# EAGLE design ECE411-Group6-V2 (EAGLE 8.3.2)
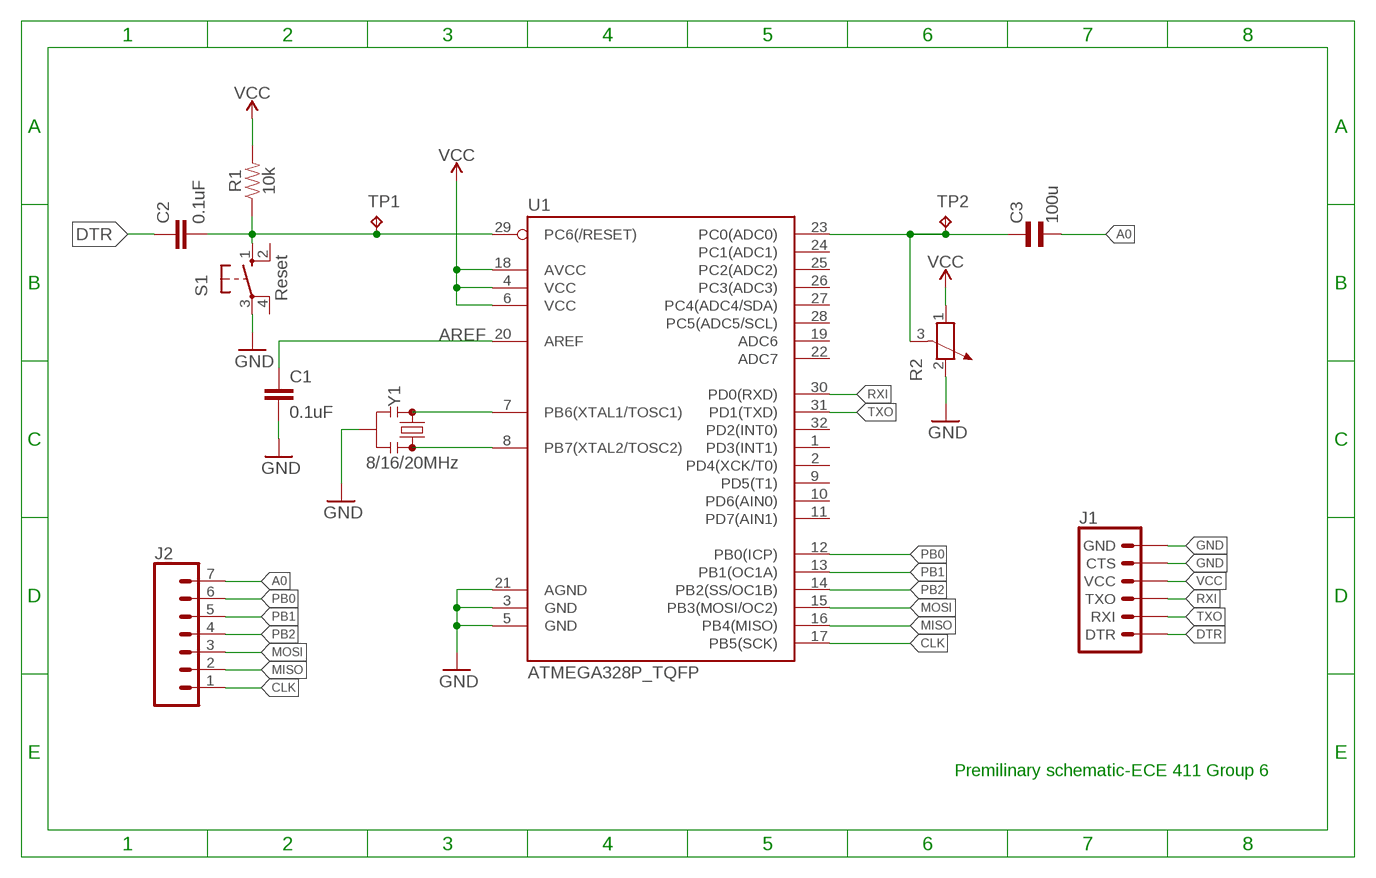
[diagram p0: schematic, sheet 1]

## Parts
C1  0.1uF  0.1UF-0603-25V-5%  [0603]
C2  0.1uF  0.1UF-0603-25V-5%  [0603]
C3  100u  EL-BI25-10AXIAL  [EU25-10]
J1  6_PIN_SERIAL_TARGET  [1X06]
J2  CONN_07  [1X07]
R1  10k  10KOHM-0603-1/10W-1%  [0603]
R2  POTENTIOMETER_PT-10  [PT-10]
S1  Reset  10-XX  [B3F-10XX]
TP1  TPB1,27  [B1,27]
TP2  TPB1,27  [B1,27]
U1  ATMEGA328P_TQFP  [TQFP32-08]
Y1  8/16/20MHz  RESONATORSMD-3.2X1.3  [RESONATOR-SMD-3.2X1.3]

## Nets
A0: C3.2 J2.7
AREF: C1.1 U1.20(AREF)
CLK: J2.1 U1.17(PB5(SCK))
DTR: C2.1 J1.1(DTR)
GND: C1.2 J1.5(CTS) J1.6(GND) R2.2 S1.3(P) U1.3(GND) U1.5(GND) U1.21(AGND) Y1.2
MISO: J2.2 U1.16(PB4(MISO))
MOSI: J2.3 U1.15(PB3(MOSI/OC2))
N$1: U1.7(PB6(XTAL1/TOSC1)) Y1.1
N$2: U1.8(PB7(XTAL2/TOSC2)) Y1.3
N$3: C2.2 R1.1 S1.1(S) TP1.TP U1.29(PC6(/RESET))
N$4: C3.1 R2.3 TP2.TP U1.23(PC0(ADC0))
PB0: J2.6 U1.12(PB0(ICP))
PB1: J2.5 U1.13(PB1(OC1A))
PB2: J2.4 U1.14(PB2(SS/OC1B))
RXI: J1.3(TXO) U1.30(PD0(RXD))
TXO: J1.2(RXI) U1.31(PD1(TXD))
VCC: J1.4(VCC) R1.2 R2.1 U1.4(VCC) U1.6(VCC) U1.18(AVCC)
Unconnected: S1.2(S1) S1.4(P1) U1.1(PD3(INT1)) U1.2(PD4(XCK/T0)) U1.9(PD5(T1)) U1.10(PD6(AIN0)) U1.11(PD7(AIN1)) U1.19(ADC6) U1.22(ADC7) U1.24(PC1(ADC1)) U1.25(PC2(ADC2)) U1.26(PC3(ADC3)) U1.27(PC4(ADC4/SDA)) U1.28(PC5(ADC5/SCL)) U1.32(PD2(INT0))

## Notes on the sheet
- Premilinary schematic-ECE 411 Group 6

## Library data of the parts
C1 C2 = SparkFun-Capacitors:0.1UF: 0.1µF ceramic capacitors A capacitor is a passive two-terminal electrical component used to store electrical energy temporarily in an electric field.; PROD_ID: CAP-08604
C3 = rcl:EL-: BIPOLAR ELECTROLYTIC CAPACITOR
J1 = SparkFun-Connectors:6_PIN_SERIAL_TARGET: 6-pin header connection for use with the "FTDI BASIC" pinout - TARGET SIDE. Also known as "Arduino Serial Program Header". It is used to mate with our FTDI Basic serial programmers using the Arduino IDE. Note, this device has "TARGET" in the name. It is intended to be used on a design that contains a target micro-controller that you wish to program. The "sister" device, named "CABLE" is inteneded to be used on a design that usually lives on the end of your USB cable and prvides the converter chip (FTDI232 or FTDI231x) to commnicate serial RX/TX. You can populate with some of these: Break Away Headers - Straight <https://www.sparkfun.com/products/116> (PRT-00116) For reference (or to suit your programming needs) check out these designs: SparkFun FTDI Basic Breakout - 5V <https://www.sparkfun.com/products/9716> (DEV-09716) SparkFun FTDI Basic Breakout - 3.3V <https://www.sparkfun.com/products/9873> (DEV-09873) SparkFun FTDI SmartBasic <https://www.sparkfun.com/products/12935> (DEV-12935) SparkFun Beefy 3 - FTDI Basic Breakout <https://www.sparkfun.com/products/13746> (DEV-13746)
J2 = SparkFun-Connectors:CONN_07: Multi connection point. Often used as Generic Header-pin footprint for 0.1 inch spaced/style header connections On any of the 0.1 inch spaced packages, you can populate with these: Break Away Headers - Straight <https://www.sparkfun.com/products/116> (PRT-00116) Break Away Male Headers - Right Angle <https://www.sparkfun.com/products/553> (PRT-00553) Female Headers <https://www.sparkfun.com/products/115> (PRT-00115) Break Away Headers - Machine Pin <https://www.sparkfun.com/products/117> (PRT-00117) Break Away Female Headers - Swiss Machine Pin <https://www.sparkfun.com/products/743> (PRT-00743) For SCREWTERMINALS and SPRING TERMINALS visit here: Screw Terimnals on SparkFun.com <https://www.sparkfun.com/search/results?term=Screw+Terminals> (5mm/3.5mm/2.54mm spacing) This device is also useful as a general connection point to wire up your design to another part of your project. Our various solder wires solder well into these plated through hole pads. Hook-Up Wire - Assortment (Stranded, 22 AWG) <https://www.sparkfun.com/products/11375> (PRT-11375) Hook-Up Wire - Assortment (Solid Core, 22 AWG) <https://www.sparkfun.com/products/11367> (PRT-11367) View the entire wire category on our website here <https://www.sparkfun.com/categories/141> Special notes: Molex polarized connector foot print use with SKU : PRT-08231 with associated crimp pins and housings. 1MM SMD Version SKU: PRT-10208 NOTES ON THE VARIANTS LOCK and LOCK_LONGPADS... This footprint was designed to help hold the alignment of a through-hole component (i.e. 6-pin header) while soldering it into place. You may notice that each hole has been shifted either up or down by 0.005 of an inch from it's more standard position (which is a perfectly straight line). This slight alteration caused the pins (the squares in the middle) to touch the edges of the holes. Because they are alternating, it causes a "brace" to hold the component in place. 0.005 has proven to be the perfect amount of "off-center" position when using our standard breakaway headers. Although looks a little odd when you look at the bare footprint, once you have a header in there, the alteration is very hard to notice. Also,if you push a header all the way into place, it is covered up entirely on the bottom side.
R1 = SparkFun-Resistors:10KOHM: 10kΩ resistor A resistor is a passive two-terminal electrical component that implements electrical resistance as a circuit element. Resistors act to reduce current flow, and, at the same time, act to lower voltage levels within circuits. - Wikipedia; PROD_ID: RES-00824
R2 = rcl:POTENTIOMETER_: Potentiometer
S1 = switch-omron:10-XX: OMRON SWITCH; MPN: B3F-1000; OC_FARNELL: 176432; OC_NEWARK: 36M3542
TP1 TP2 = testpad:TP: Test pad
U1 = SparkFun-IC-Microcontroller:ATMEGA328P_TQFP: Popular 328P in QFP Storefront component: ATmega328 - TQFP <https://www.sparkfun.com/products/13448> (COM-13448) Datasheet <http://www.sparkfun.com/datasheets/Components/SMD/ATMega328.pdf> SparkFun Products SparkFun RedBoard - Programmed with Arduino <https://www.sparkfun.com/products/12757> (DEV-12757) Arduino Pro Mini 328 - 5V/16MHz <https://www.sparkfun.com/products/11113> (DEV-11113) Arduino Pro Mini 328 - 3.3V/8MHz <https://www.sparkfun.com/products/11114> (DEV-11114) SparkFun OpenLog <https://www.sparkfun.com/products/13712> (DEV-13712) SparkFun MicroView - OLED Arduino Module <https://www.sparkfun.com/products/12923> (DEV-12923) SparkFun Digital Sandbox <https://www.sparkfun.com/products/12651> (DEV-12651) SparkFun PicoBoard <https://www.sparkfun.com/products/11888> (WIG-11888) Arduino Fio <https://www.sparkfun.com/products/10116> (DEV-10116) LilyPad Arduino 328 Main Board <https://www.sparkfun.com/products/13342> (DEV-13342) SparkFun RedStick <https://www.sparkfun.com/products/13741> (DEV-13741) LilyPad MP3 <https://www.sparkfun.com/products/11013> (DEV-11013) LilyPad Arduino SimpleSnap <https://www.sparkfun.com/products/10941> (DEV-10941) SparkFun Stepoko <https://www.sparkfun.com/products/13899> (ROB-13899) SparkFun Geiger Counter <https://www.sparkfun.com/products/11345> (SEN-11345) SparkFun EL Sequencer <https://www.sparkfun.com/products/12781> (COM-12781) Arduino Pro 328 - 5V/16MHz <https://www.sparkfun.com/products/10915> (DEV-10915) CryptoCape <https://www.sparkfun.com/products/12773> (DEV-12773) SparkFun IR Thermometer Evaluation Board - MLX90614 <https://www.sparkfun.com/products/10740> (SEN-10740) SparkFun RedBot Mainboard <https://www.sparkfun.com/products/12097> (ROB-12097) Arduino Pro 328 - 3.3V/8MHz <https://www.sparkfun.com/products/10914> (DEV-10914) SparkFun Block for Intel® Edison - Arduino <https://www.sparkfun.com/products/13036> (DEV-13036) SparkFun Simon Says - Surface Mount Soldering Kit <https://www.sparkfun.com/products/10935> (KIT-10935) SparkFun 7-Segment Serial Display - Red <https://www.sparkfun.com/products/11441> (COM-11441) SparkFun 7-Segment Serial Display - White <https://www.sparkfun.com/products/11629> (COM-11629) SparkFun 7-Segment Serial Display - Yellow <https://www.sparkfun.com/products/11443> (COM-11443) SparkFun 7-Segment Serial Display - Kelly Green <https://www.sparkfun.com/products/11440> (COM-11440) SparkFun 7-Segment Serial Display - Blue <https://www.sparkfun.com/products/11442> (COM-11442) SparkFun OpenSegment Serial Display - 20mm (Blue) <https://www.sparkfun.com/products/11647> (COM-11647) SparkFun OpenSegment Serial Display - 20mm (Green) <https://www.sparkfun.com/products/11646> (COM-11646) SparkFun OpenSegment Serial Display - 20mm (White) <https://www.sparkfun.com/products/11648> (COM-11648) SparkFun OpenSegment Serial Display - 20mm (Red) <https://www.sparkfun.com/products/11644> (COM-11644) SparkFun OpenSegment Serial Display - 20mm (Yellow) <https://www.sparkfun.com/products/11645> (COM-11645) SparkFun OpenSegment Shield <https://www.sparkfun.com/products/13190> (DEV-13190); PROD_ID: IC-09069
Y1 = SparkFun-Clocks:RESONATOR: Resonators (Generic) Ceramic resonators are clock-generating components, often used to control timing in microcontrollers. They usually have 3 pins: two pins for oscillation, and one pin for ground. Compared to crystals, resonators have worse tolerance, but are usually much cheaper. Plus, they have built-in load capacitors! These devices are used on boards like the Arduino Pro 8MHz <https://www.sparkfun.com/products/11114> and Arduino Pro 16MHz <https://www.sparkfun.com/products/11113>.

## Board
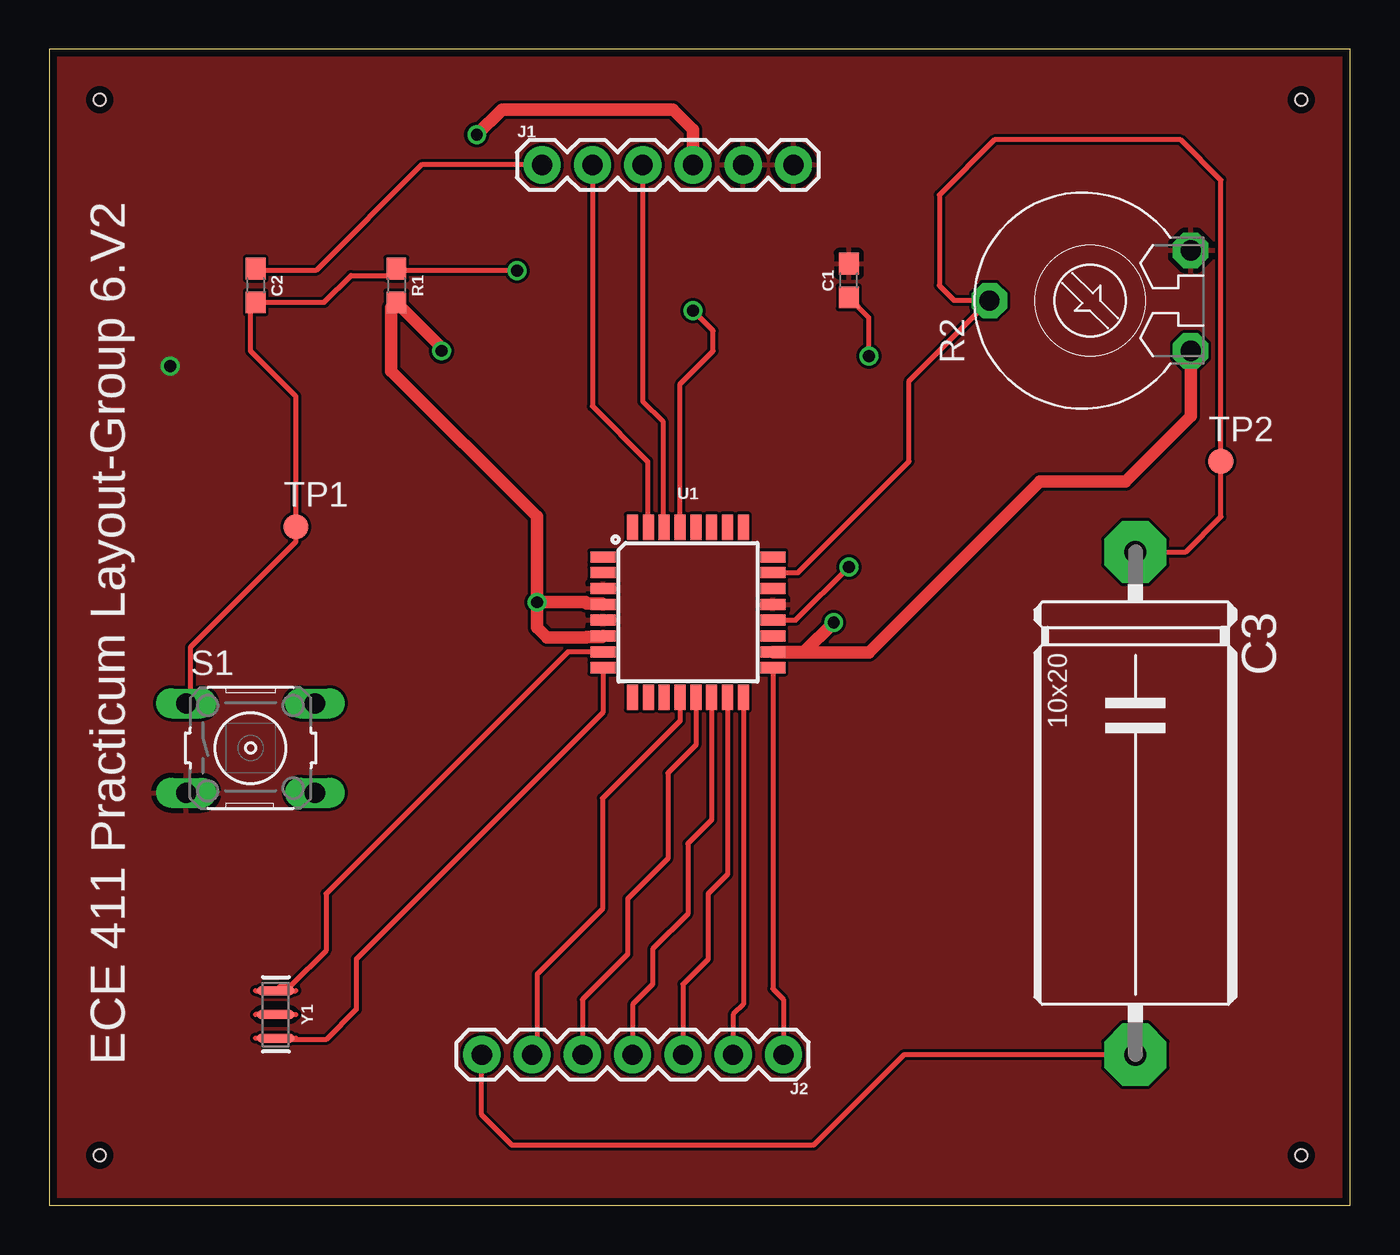
[diagram p1: board, top side]
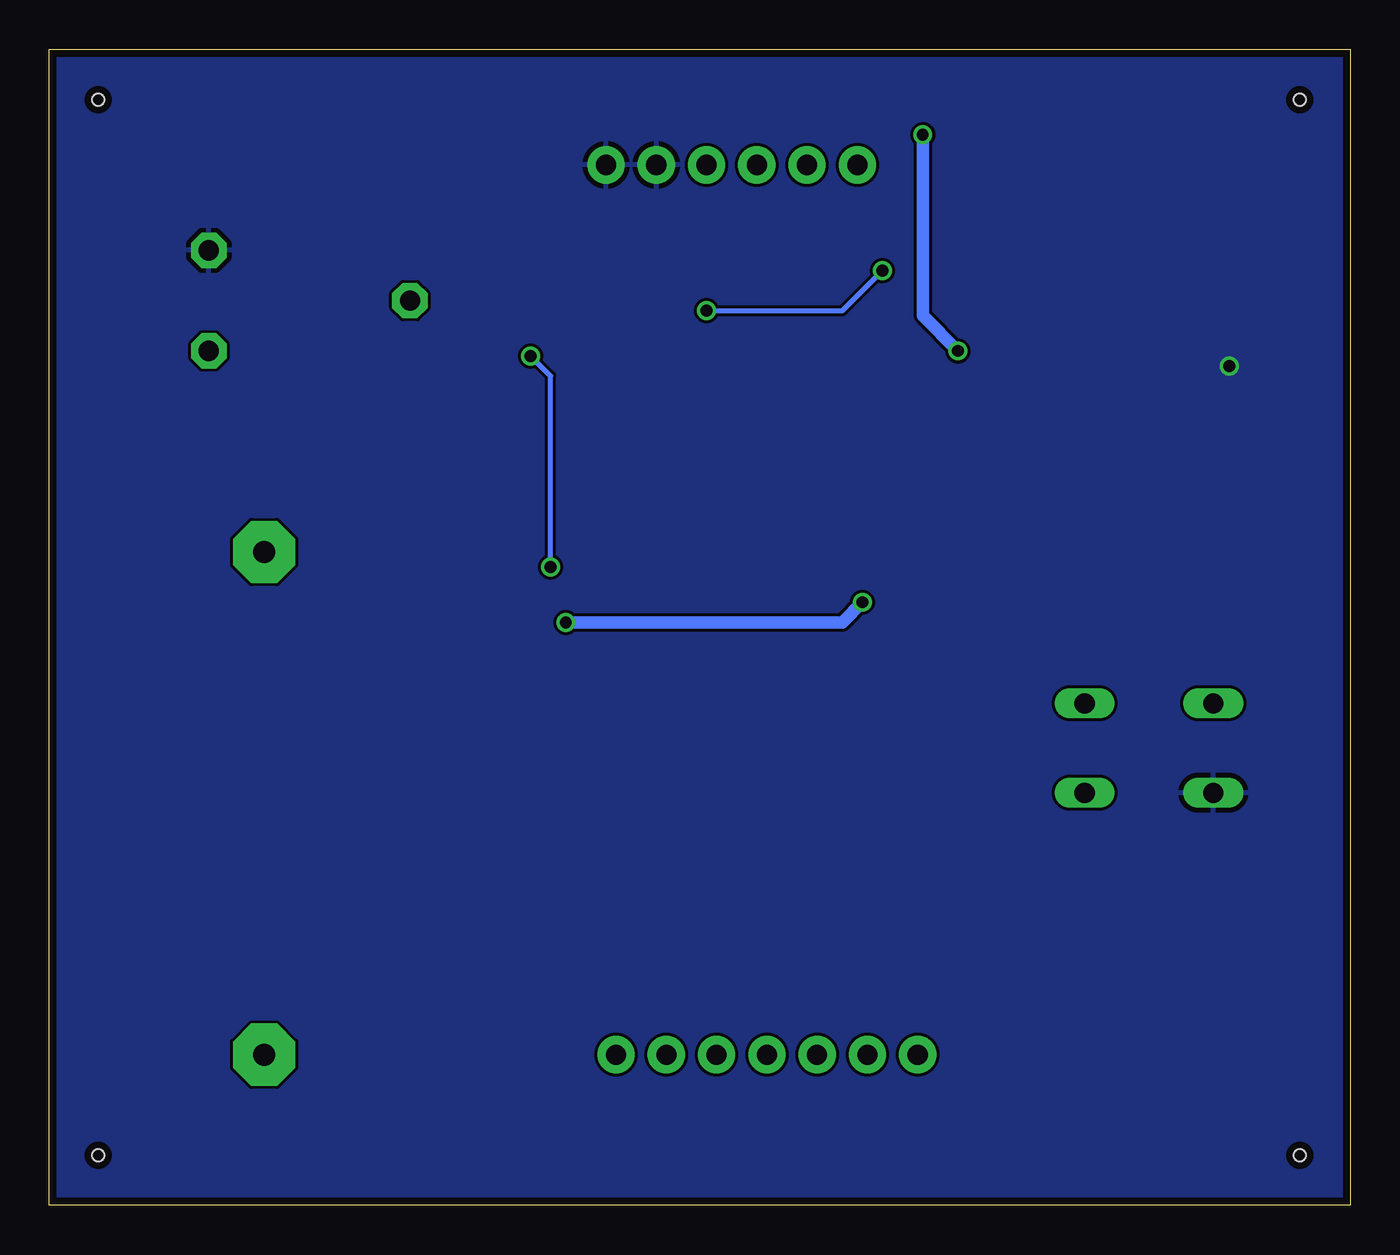
[diagram p2: board, bottom side, seen from below]

Size 65.71 x 58.41 mm. Coordinates in mm from the lower left corner, seen from the top.
Outline: 0,0 65.71,0 65.71,58.41 0,58.41 0,0
Copper layers (1*16): Top 0.0356mm / dielectric 1.5011mm / Bottom 0.0356mm
Design rules "osh-park-2-layers-design-rules": minimum track width 6mil, minimum drill 10mil, track to track 6mil, track to pad 6mil, pad to pad 6mil, via to via 6mil, smd to smd 6mil, copper to edge 15mil, drill to drill 6mil, minimum pad ring 7mil, minimum via ring 7mil, stop-mask expansion 3mil, vias tented up to drill 0mil, thermal gap 10mil
Holes 0.6 mm at 2.54,55.88 2.54,2.54 63.25,2.54 63.25,55.88

### Footprints (pad centres in the part's own frame; a part is rotated, then mirrored left to right if it is on the bottom)
0603 = smd 1.1 x 1: 1 -0.85,0; 2 0.85,0
EU25-10 = drill 1.118 pad 3.15 octagon: 1 -12.7,0; 2 12.7,0
1X06 = drill 1.016 pad 1.88: 1 0,0; 2 2.54,0; 3 5.08,0; 4 7.62,0; 5 10.16,0; 6 12.7,0
1X07 = drill 1.016 pad 1.88: 1 0,0; 2 2.54,0; 3 5.08,0; 4 7.62,0; 5 10.16,0; 6 12.7,0; 7 15.24,0
PT-10 = drill 1.016 pad 1.778 octagon: 1 -2.54,-5.08; 2 2.54,-5.08; 3 0,5.08
B3F-10XX = drill 1.016 long: 1 -3.251,2.261; 2 3.251,2.261; 3 -3.251,-2.261; 4 3.251,-2.261
B1,27 = smd 1.27 x 1.27: TP 0,0
TQFP32-08 = smd 1.27 x 0.559: 1 -4.293,2.8; 2 -4.293,2; 3 -4.293,1.2; 4 -4.293,0.4; 5 -4.293,-0.4; 6 -4.293,-1.2; 7 -4.293,-2; 8 -4.293,-2.8; 17 4.293,-2.8; 18 4.293,-2; 19 4.293,-1.2; 20 4.293,-0.4; 21 4.293,0.4; 22 4.293,1.2; 23 4.293,2; 24 4.293,2.8 | smd 0.559 x 1.27: 9 -2.8,-4.293; 10 -2,-4.293; 11 -1.2,-4.293; 12 -0.4,-4.293; 13 0.4,-4.293; 14 1.2,-4.293; 15 2,-4.293; 16 2.8,-4.293; 25 2.8,4.293; 26 2,4.293; 27 1.2,4.293; 28 0.4,4.293; 29 -0.4,4.293; 30 -1.2,4.293; 31 -2,4.293; 32 -2.8,4.293
RESONATOR-SMD-3.2X1.3 = smd 0.45 x 1.905: 1 -1.2,0; 2 0,0; 3 1.2,0

### Placement (x,y rotation side)
C1  40.39,46.74 90 top
C2  10.41,46.48 270 top
C3  54.86,20.32 270 top
J1  24.89,52.58 0 top
J2  37.08,7.62 180 top
R1  17.53,46.48 270 top
R2  52.58,45.72 90 top
S1  10.16,23.11 0 top
TP1  12.45,34.29 0 top
TP2  59.18,37.59 0 top
U1  32.26,29.97 0 top
Y1  11.43,9.65 270 top

### Tracks (layer width: path | path; a pad name or v marks a point on that pad's centre or on a via)
A0
  Top 0.254: C3.2 43.18,7.62 38.61,3.05 23.37,3.05 21.84,4.57 J2.7
AREF  (via drill 0.6)
  Top 0.254: U1.20 37.7,29.57 v40.39,32.26 | v41.4,42.93 41.4,44.87 C1.1
  Bottom 0.254: v40.39,32.26 40.39,41.91 v41.4,42.93
CLK
  Top 0.254: U1.17 36.55,10.95 37.08,10.41 J2.1
DTR
  Top 0.254: J1.1 18.8,52.58 13.46,47.24 10.5,47.24 C2.1
GND  (via drill 0.6)
  other vias: 6.1,42.42
  pour Top: -0.51,58.93 -0.51,-0.51 66.29,-0.51 66.29,58.93
  pour Bottom: -0.51,58.93 -0.51,-0.76 66.55,-0.76 66.55,58.67 66.55,58.93
MISO
  Top 0.254: U1.16 35.06,10.17 34.54,9.65 J2.2
MOSI
  Top 0.254: U1.15 34.26,16.73 33.27,15.75 33.27,12.45 32,11.18 J2.3
N$1
  Top 0.254: U1.7 26.19,27.97 13.97,15.75 13.97,12.88 12.19,11.1 11.68,11.1 Y1.1
N$2
  Top 0.254: U1.8 27.96,24.92 15.49,12.45 15.49,9.91 13.97,8.38 11.5,8.38 Y1.3
N$3  (via drill 0.6)
  Top 0.254: 17.36,47.16 R1.1 | 17.36,47.16 17.18,46.99 15.24,46.99 13.88,45.63 C2.2 10.16,45.38 10.16,43.18 12.45,40.89 TP1.TP 12.45,33.53 7.11,28.19 7.11,25.58 S1.1 | U1.29 31.86,41.51 33.53,43.18 33.53,44.2 v32.51,45.21 | v23.62,47.24 17.44,47.24 17.36,47.16
  Bottom 0.254: v32.51,45.21 25.65,45.21 v23.62,47.24
N$4
  Top 0.254: C3.1 57.4,33.02 59.18,34.8 TP2.TP 59.18,51.82 57.15,53.85 47.75,53.85 44.96,51.05 44.96,46.48 45.72,45.72 R2.3 43.43,41.66 43.43,37.59 37.81,31.97 U1.23
PB0
  Top 0.254: U1.12 31.86,24.49 27.94,20.57 27.94,14.99 24.64,11.68 24.64,7.87 J2.6
PB1
  Top 0.254: U1.13 32.66,23.26 31.24,21.84 31.24,17.53 29.21,15.49 29.21,12.7 26.92,10.41 J2.5
PB2
  Top 0.254: U1.14 33.46,19.49 32.26,18.29 32.26,14.73 30.48,12.95 30.48,11.18 29.46,10.16 J2.4
RXI
  Top 0.254: J1.3 29.97,40.64 30.99,39.62 30.99,34.34 U1.30
TXO
  Top 0.254: J1.2 27.43,40.39 30.23,37.59 30.23,34.3 U1.31
VCC  (via drill 0.6)
  Top 0.635: R2.1 57.66,39.88 54.36,36.58 50.04,36.58 41.4,27.94 36.58,27.94 U1.18 38.13,27.97 v39.62,29.46 | v24.64,30.48 27.08,30.48 27.14,30.42 27.91,30.42 U1.4 | v24.64,30.48 24.64,34.8 17.27,42.16 17.27,45.38 R1.2 19.81,43.35 v19.81,43.18 | v24.64,30.48 24.64,29.21 25.15,28.7 27.12,28.7 27.14,28.72 27.91,28.72 U1.6 | J1.4 32.51,54.36 31.5,55.37 22.86,55.37 v21.59,54.1
  Bottom 0.635: v39.62,29.46 25.65,29.46 v24.64,30.48 | v21.59,54.1 21.59,44.96 v19.81,43.18

### Text on the board
tPlace: ECE 411 Practicum Layout-Group 6.V2